# Altium schematic sheet Temp_and_Humi_SHTC3.SchDoc: Smart Street Light System - Temp Sensor Schematic Doc
size 431 x 279 mm; Author: Arvind Balaji Narayan, Gopik Anand; CompanyName: Cats_and_Dogs; Engineer: Arvind Balaji Narayan, Gopik Anand; Organization: University of Pennsylvania
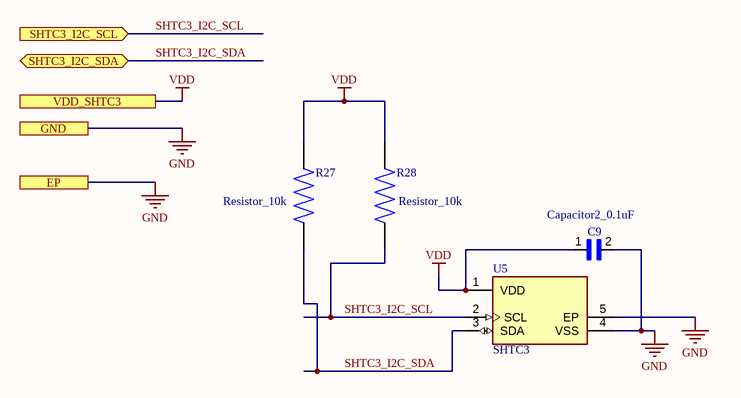
[diagram p0: Temp_and_Humi_SHTC3.SchDoc]

## Parts
C9  Capacitor2_0.1uF  [Capacitor2_0.1uF]
R27  Resistor_10k  [Resistor_10k]
R28  Resistor_10k  [Resistor_10k]
U5  SHTC3  [FP-SHTC3-MFG]

## Ports
EP, GND, SHTC3_I2C_SCL (in), SHTC3_I2C_SDA (bidir), VDD_SHTC3

## Nets
GND: C9.2 U5.4(VSS) U5.5(EP) ; port GND, port EP
VDD: C9.1 R27.2 R28.2 U5.1(VDD) ; port VDD_SHTC3
SHTC3_I2C_SCL: R28.1 U5.2(SCL) ; port SHTC3_I2C_SCL
SHTC3_I2C_SDA: R27.1 U5.3(SDA) ; port SHTC3_I2C_SDA

## Notes on the sheet
- DWG. NO.
- REV.
- SHT.
- THIS DOCUMENT AND THE DATA DISCLOSED HEREIN OR HEREWITH IS THE PROPERTY OF ALTIUM LIMITED AND MAY BE FREELY DISTRIBUTED IN WHOLE. NO RIGHTS ARE RESERVED OR EXPRESS OR IMPLIED WARANTEE GIVEN.
- REVISION
- DESCRIPTION
- DATE
- APPROVED
- ENG:
- APPROVALS
- PROJECT
- DSN:
- CHK:
- REFERENCE DOCUMENTS
- PROJECT REVISION:
- TITLE
- DOCUMENT REVISION:
- DESIGN ITEM:
- BOM:
- FAB DWG:
- PCB DWG:
- ASSY DWG:
- SCALE:
- SIZE
- B
- CAGE CODE
- FILE NAME
- DWG NO.
- SHEET
- OF
- REV

## Library data of the parts
C9 = Capacitor2_0.1uF: Cap Ceramic 0.1uF 16V X5R 10% SMD 0402 85°C Paper T/R; Manufacturer: KEMET; Manufacturer Part Number: C0402C104K4PACTU; Capacitance: 100nF; Dissipation Factor: 5%; Supplier 1: Digi-Key; Supplier Part Number 1: 399-C0402C104K4PAC7867TR-ND; RoHS: Yes; Category: Ceramic Capacitors; Stock 1: 2168149; Pricing 1: 10000=0.00873, 20000=0.00832 (USD); Mount: Surface Mount; Case/Package: 0402; Case Code (Metric): 1005; Case Code (Imperial): 0402; Contact Plating: Tin,Matte; Dielectric Material: Ceramic; Min Operating Temperature: -55°C; Max Operating Temperature: 85°C; Tolerance: 10%; Packaging: Tape and Reel; Voltage Rating: 16V; Package Quantity: 1; Voltage Rating (DC): 16V; Dielectric: X5R; Termination: SMD/SMT; Series: C; Construction: Flat; Length: 1mm; Width: 0.02inch; Height: 0.5mm; Thickness: 0.022inch; Depth: 0.5mm; Radiation Hardening: No; REACH SVHC: No SVHC; Lead Free: Lead Free; RoHS Compliant: Yes; ComponentLink1URL: https://datasheet.ciiva.com/26938/getdatasheetpartid-161478-26938210.pdf?src-supplier=Verical; ComponentLink1Description: https://datasheet.ciiva.com/26938/getdatasheetpartid-161478-26938210.pdf?src-supplier=Verical
R27 R28 = Resistor_10k: Res Thin Film 0805 10K Ohm 1% 1/10W ±50ppm/°C Molded SMD SMD Paper T/R; Manufacturer: TE Connectivity Neohm; Manufacturer Part Number: CPF0805F10KC1; Resistance: 10kR; Max Power Dissipation: 100mW; Number of Resistors: 1; Voltage Rating: 100V; Supplier 1: Mouser; Supplier Part Number 1: 279-CPF0805F10KC1; RoHS: Yes; Category: Chip SMD Resistors; Stock 1: 2893; Pricing 1: 1=0.12000, 10=0.10000, 50=0.10000, 100=0.05400, 1000=0.02200, 10000=0.02200 (USD); Mount: Surface Mount; Case/Package: 0805; Min Operating Temperature: -55°C; Max Operating Temperature: 155°C; Packaging: Tape and Reel; Number of Terminations: 2; Temperature Coefficient: 50ppm/°C; Tolerance: 1%; Series: CPF, Neohm; Power Rating: 100mW; Termination: Solder; RoHS Compliant: Yes; ELV: Compliant; ComponentLink1URL: https://www.te.com/commerce/DocumentDelivery/DDEController?Action=srchrtrv&amp;DocNm=1773200&amp;DocType=DS&amp;DocLang=English&src-supplier=Digi-Key; ComponentLink1Description: https://www.te.com/commerce/DocumentDelivery/DDEController?Action=srchrtrv&amp;DocNm=1773200&amp;DocType=DS&amp;DocLang=English&src-supplier=Digi-Key
U5 = CMP-144040-000003-1: SENSOR HUMI/TEMP I2C 2% SMD; Manufacturer: Sensirion; Operating Supply Current: 0.3-900uA; Resolution: 16bits; Min Supply Voltage: 1.62V; Max Supply Voltage: 3.6V; Category: IC; Device Class L3: unset; ComponentLink2URL: https://www.sensirion.com/fileadmin/user_upload/customers/sensirion/Dokumente/0_Datasheets/Humidity/Sensirion_Humidity_Sensors_SHTC3_Datasheet.pdf; Ipc Land Pattern Name: DFN200X200X75-4; RoHS: TRUE; Height: 0.75mm; Interface: I2C; Temperature Range High: +125°C; Accuracy: 2%; Sensor Output: I2C; Automotive: No; Package: 0; Device Class L1: Sensors; Manufacturer Part Number: SHTC3; Digikey Description: SENSOR HUMI/TEMP I2C 2% SMD; Lead Free: Yes; Temperature: -40°C to +125°C; Device Class L2: Temperature and Humidity Sensors; ComponentLink2Description: Datasheet; Octopart: https://octopart.com/shtc3-sensirion-91912225; Mouser Description: SHTC3 Series 0 to 100% RH 3.6 V Humidity and Temperature Sensor IC - DFN-4; Temperature Range Low: -40°C